# Altium project MAX_2870.PrjPCB
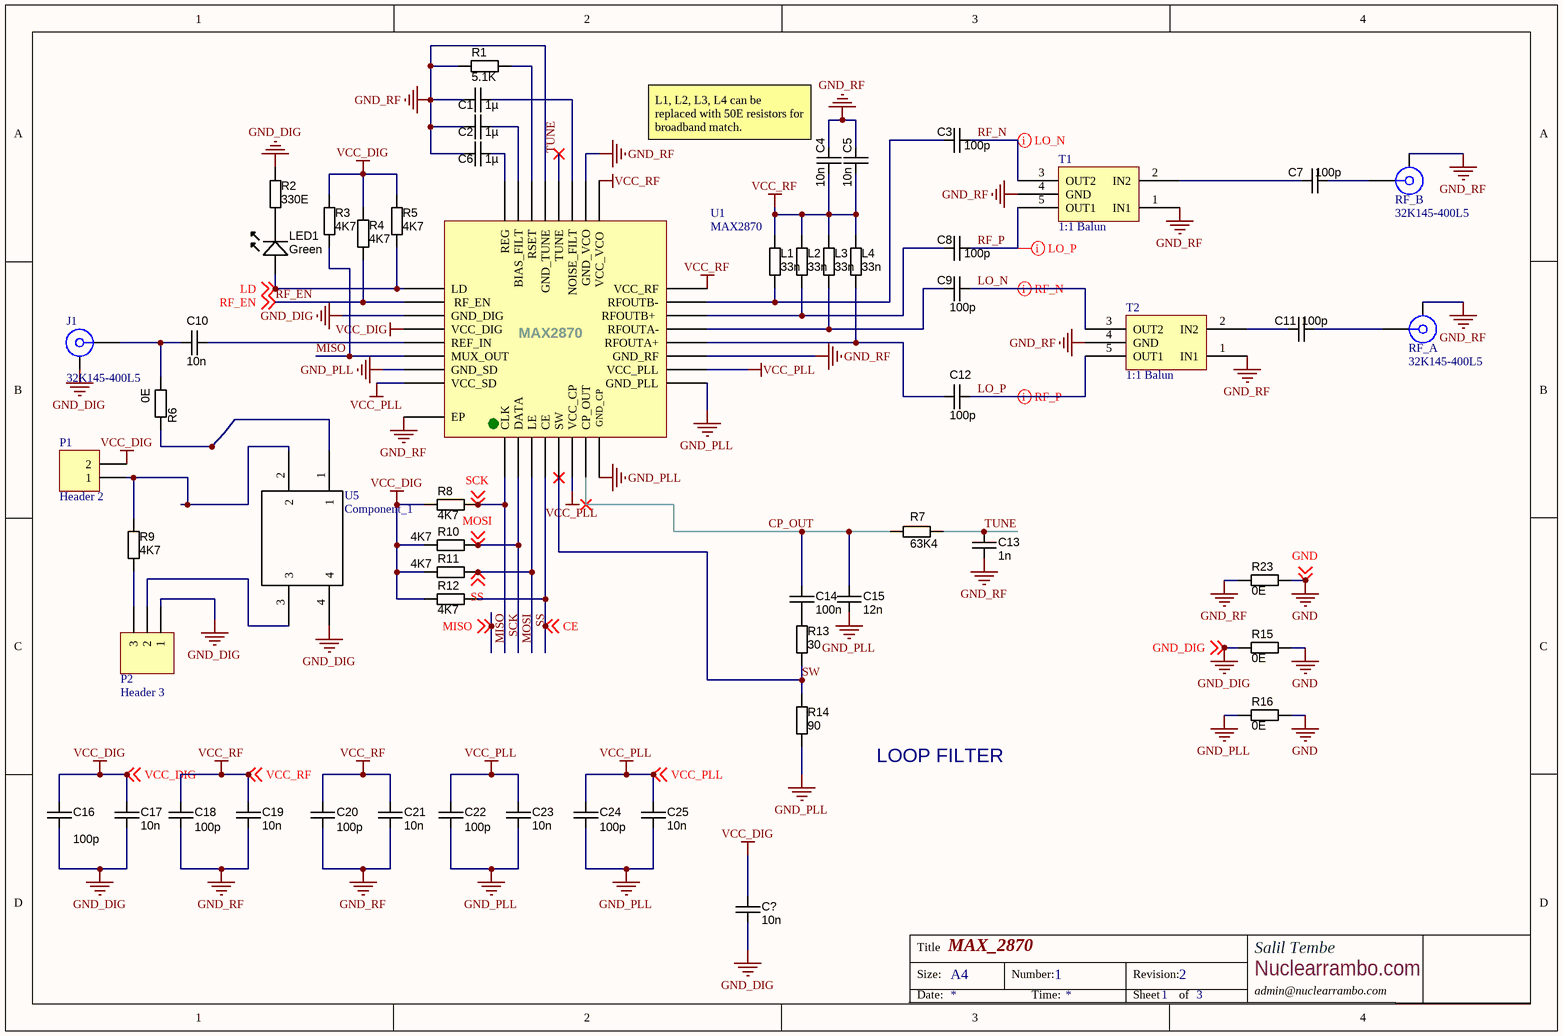
[diagram p0: MAX_2870.SchDoc]
3 sheets, 89 parts. Net scope: flat (ports and power ports of the same name join across sheets).
Board file: MAX_2870.PcbDoc
Sheets:
  MAX_2870.SchDoc
  Power_Supply.SchDoc
  PLL_Controller_STM32.SchDoc

## Sheet MAX_2870.SchDoc: MAX_2870
size A4; Author: Salil Tembe; DrawnBy: Salil Tembe; Organization: Salil Tembe; Address1: Nuclearrambo.com; Address2: admin@nuclearrambo.com; DocumentNumber: 1; Revision: 2; SheetNumber: 1; SheetTotal: 3

### Parts
C1  value 1µ  [CAPC1608X90N]  (hidden comment: approved sub OK)
C2  value 1µ  [CAPC1608X90N]  (hidden comment: approved sub OK)
C3  100p  [CAPC1005X55N]
C4  value 10n  [CAPC1608X90N]  (hidden comment: approved sub OK)
C5  value 10n  [CAPC1608X90N]  (hidden comment: approved sub OK)
C6  value 1µ  [CAPC1608X90N]  (hidden comment: approved sub OK)
C7  100p  [CAPC1005X55N]
C8  100p  [CAPC1005X55N]
C9  100p  [CAPC1005X55N]
C10  value 10n  [CAPC1608X90N]  (hidden comment: approved sub OK)
C11  100p  [CAPC1005X55N]
C12  100p  [CAPC1005X55N]
C13  1n  [CAPC1608X90N]
C14  value 100n  [CAPC1608X90N]  (hidden comment: approved sub OK)
C15  12n  [CAPC1608X90N]
C16  100p  [CAPC1608X90N]
C17  value 10n  [CAPC1608X90N]  (hidden comment: approved sub OK)
C18  100p  [CAPC1608X90N]
C19  value 10n  [CAPC1608X90N]  (hidden comment: approved sub OK)
C20  100p  [CAPC1608X90N]
C21  value 10n  [CAPC1608X90N]  (hidden comment: approved sub OK)
C22  100p  [CAPC1608X90N]
C23  value 10n  [CAPC1608X90N]  (hidden comment: approved sub OK)
C24  100p  [CAPC1608X90N]
C25  value 10n  [CAPC1608X90N]  (hidden comment: approved sub OK)
C?  value 10n  [CAPC1608X90N]  (hidden comment: approved sub OK)
J1  32K145-400L5  [ROS-32K145-400L5_V]
L1  value 33n  [RESC1005X40N]  (hidden comment: Thick Film)
L2  value 33n  [RESC1005X40N]  (hidden comment: Thick Film)
L3  value 33n  [RESC1005X40N]  (hidden comment: Thick Film)
L4  value 33n  [RESC1005X40N]  (hidden comment: Thick Film)
LED1  Green  [LED-0603-GREEN]
P1  Header 2  [HDR1X2]
P2  Header 3  [HDR1X3]
R1  value 5.1K  [RESC2012X70N]  (hidden comment: Thick Film)
R2  value 330E  [RESC1608X55N]  (hidden comment: Thick Film)
R3  value 4K7  [RESC1005X40N]  (hidden comment: Thick Film)
R4  value 4K7  [RESC1005X40N]  (hidden comment: Thick Film)
R5  value 4K7  [RESC1005X40N]  (hidden comment: Thick Film)
R6  value 0E  [RESC1608X55N]  (hidden comment: Thick Film)
R7  value 63K4  [RESC1608X55N]  (hidden comment: Thick Film)
R8  value 4K7  [RESC1005X40N]  (hidden comment: Thick Film)
R9  value 4K7  [RESC2012X70N]  (hidden comment: Thick Film)
R10  value 4K7  [RESC1005X40N]  (hidden comment: Thick Film)
R11  value 4K7  [RESC1005X40N]  (hidden comment: Thick Film)
R12  value 4K7  [RESC1005X40N]  (hidden comment: Thick Film)
R13  value 30  [RESC1608X55N]  (hidden comment: Thick Film)
R14  value 90  [RESC1608X55N]  (hidden comment: Thick Film)
R15  value 0E  [RESC1608X55N]  (hidden comment: Thick Film)
R16  value 0E  [RESC1608X55N]  (hidden comment: Thick Film)
R23  value 0E  [RESC1608X55N]  (hidden comment: Thick Film)
RF_A  32K145-400L5  [ROS-32K145-400L5_V]
RF_B  32K145-400L5  [ROS-32K145-400L5_V]
T1  1:1 Balun  [ETC-1-1-13R]
T2  1:1 Balun  [ETC-1-1-13R]
U1  MAX2870  [TQFN]
U5  Component_1  [5mm x 7mm TCXO]

### Nets
GND: R15.2 R16.2 R23.2 ; off-sheet GND
GND_DIG: C16.2 C17.2 C?.2 J1.MP P2.1 R2.1 R15.1 U1.27(GND_DIG) U5.4 ; off-sheet GND_DIG
GND_PLL: C15.1 C22.2 C23.2 C24.2 C25.2 R14.2 R16.1 U1.8(GND_CP) U1.9(GND_PLL) U1.31(GND_SD)
GND_RF: C1.2 C2.1 C4.2 C5.2 C6.1 C13.2 C18.2 C19.2 C20.2 C21.2 R1.2 R23.1 RF_A.MP RF_B.MP T1.1(IN1) T1.4(GND) T2.1(IN1) T2.4(GND) U1.11(GND_RF) U1.18(GND_VCO) U1.21(GND_TUNE) U1.33(EP)
VCC_DIG: C16.1 C17.1 C?.1 P1.2 R3.2 R4.2 R5.2 R8.1 R10.1 R11.1 R12.1 U1.28(VCC_DIG) ; off-sheet VCC_DIG
VCC_PLL: C22.1 C23.1 C24.1 C25.1 U1.6(VCC_CP) U1.10(VCC_PLL) U1.32(VCC_SD) ; off-sheet VCC_PLL
VCC_RF: C4.1 C5.1 C18.1 C19.1 C20.1 C21.1 L1.1 L2.1 L3.1 L4.1 U1.16(VCC_RF) U1.17(VCC_VCO) ; off-sheet VCC_RF
CE: R12.2 U1.4(CE) ; off-sheet CE
CP_OUT: C14.1 C15.2 R7.2 U1.7(CP_OUT)
LD: LED1.A R5.1 U1.25(LD) ; off-sheet LD
LO_N: C9.2 T2.3(OUT2)
LO_P: C12.2 T2.5(OUT1)
MISO: R3.1 U1.30(MUX_OUT) ; off-sheet MISO
MOSI: R10.2 U1.2(DATA) ; off-sheet MOSI
RF_EN: R4.1 U1.26(RF_EN) ; off-sheet RF_EN
RF_N: C3.2 T1.3(OUT2)
RF_P: C8.2 T1.5(OUT1)
SCK: R8.2 U1.1(CLK) ; off-sheet SCK
SS: R11.2 U1.3(LE) ; off-sheet SS
SW: R13.2 R14.1 U1.5(SW)
TUNE: C13.1 R7.1 U1.20(TUNE)
NetC1_1: C1.1 U1.19(NOISE_FILT)
NetC2_2: C2.2 U1.23(BIAS_FILT)
NetC3_1: C3.1 L1.2 U1.15(RFOUTB-)
NetC6_2: C6.2 U1.24(REG)
NetC7_1: C7.1 T1.2(IN2)
NetC7_2: C7.2 RF_B.1
NetC8_1: C8.1 L2.2 U1.14(RFOUTB+)
NetC9_1: C9.1 L3.2 U1.13(RFOUTA-)
NetC10_1: C10.1 J1.1 R6.2
NetC10_2: C10.2 U1.29(REF_IN)
NetC11_1: C11.1 T2.2(IN2)
NetC11_2: C11.2 RF_A.1
NetC12_1: C12.1 L4.2 U1.12(RFOUTA+)
NetC14_2: C14.2 R13.1
NetLED1_K: LED1.K R2.2
NetP1_1: P1.1 R9.1 U5.2
NetP2_2: P2.2 U5.3
NetP2_3: P2.3 R9.2
NetR1_1: R1.1 U1.22(RSET)
NetR6_1: R6.1 U5.1

### Layout directives
differential pair: LO_N, LO_P, RF_N, RF_P

### Notes on the sheet
- (near C4) L1, L2, L3, L4 can be replaced with 50E resistors for broadband match.
- LOOP FILTER
- Title
- Size:
- A4
- Number:
- Revision:
- Date:
- Time:
- Sheet
- of

### Library data of the parts
C1 C2 C6 = CAPC_1u_0603_X7R_16V_10%: Capacitor SMD Cer 1uF 10% 16V X7R 0603; Manufacturer 1: TDK Corporation; Manufacturer Part Number 1: C1608X7R1C105K; Ratings: 16V; X7R; Material: ceramic; SCDType: spec; Package / Case: 0603 (1608 metric); Tolerance: ±10%; Supplier 1: Digi-Key; Supplier Part Number 1: 445-1604-1-ND; ComponentLink1URL: http://product.tdk.com/capacitor/mlcc/en/documents/mlcc_commercial_general_en.pdf; ComponentLink1Description: http://product.tdk.com/capacitor/mlcc/en/documents/mlcc_commercial_general_en.pdf
C3 C7-C9 C11 C12 = CAPC_100p_0402_NP0_50V_5%: Capacitor SMD Cer 100pF 5% 50V NP0 0402; Manufacturer 1: Yageo; Manufacturer Part Number 1: CC0402JRNPO9BN101; Ratings: 50V; NP0; SCDType: spec; Tolerance: ±5%; Operating Temperature: -55°C ~ 125°C; Package / Case: 0402 (1005 Metric); Size / Dimension: 0.039" L x 0.020" W (1.00mm x 0.50mm); Supplier 1: Digi-Key; Supplier Part Number 1: 311-1024-1-ND; RoHS 1: RoHS Compliant; ComponentLink1URL: http://www.yageo.com/documents/recent/UPY-GP_NP0_16V-to-50V_9.pdf; ComponentLink1Description: http://www.yageo.com/documents/recent/UPY-GP_NP0_16V-to-50V_9.pdf; Supplier 2: Digi-Key; Supplier Part Number 2: 1276-1025-1-ND; Manufacturer 2: Samsung Electro-Mechanics America, Inc; Manufacturer Part Number 2: CL05C101JB5NNNC; RoHS 2: RoHS Compliant; ComponentLink2URL: http://www.samsungsem.com/servlet/FileDownload?type=spec&file=CL05C101JB5NNNC.pdf; ComponentLink2Description: http://www.samsungsem.com/servlet/FileDownload?type=spec&file=CL05C101JB5NNNC.pdf; Supplier 3: Digi-Key; Supplier Part Number 3: 445-1247-1-ND; Manufacturer 3: TDK Corporation; Manufacturer Part Number 3: C1005C0G1H101J050BA; RoHS 3: RoHS Compliant; ComponentLink3URL: http://product.tdk.com/capacitor/mlcc/en/documents/mlcc_commercial_general_en.pdf; ComponentLink3Description: http://product.tdk.com/capacitor/mlcc/en/documents/mlcc_commercial_general_en.pdf; Supplier 4: Digi-Key; Supplier Part Number 4: 399-3194-1-ND; Manufacturer 4: Kemet; Manufacturer Part Number 4: C0402C101J5GACTU; RoHS 4: RoHS Compliant; ComponentLink4URL: http://www.kemet.com/datasheets&C0402C101J5GACTU; ComponentLink4Description: http://www.kemet.com/datasheets&C0402C101J5GACTU; Value: 100p
C4 C5 C10 C17 C19 C21 C23 C25 C? = CAPC_10n_0603_X7R_100V_10%: Capacitor SMD Cer 10nF 10% 100V X7R 0603; Manufacturer: Murata Electronics North America; Manufacturer Part Number: GCM188R72A103KA37D; Ratings: 100V; X7R; Material: ceramic; SCDType: undef; Package / Case: 0603 (1608 metric); Tolerance: ±10%; Supplier 1: Digi-Key; Supplier Part Number 1: 490-4781-1-ND
C13 C15 C16 C18 C20 C22 C24 = CAPC_100p_0603_NP0_50V_1%: Capacitor SMD Cer 100pF 1% 50V NP0 0603; Manufacturer 1: AVX Corporation; Manufacturer Part Number 1: 06035A101FAT2A; Ratings: 50V; NP0; SCDType: source; Operating Temperature: -55°C ~ 125°C; Package / Case: 0603 (1608 Metric); Size / Dimension: 0.063" L x 0.032" W (1.60mm x 0.81mm); Thickness (Max): 0.035" (0.90mm); ComponentLink1URL: http://www.avx.com/docs/Catalogs/ccog.pdf; ComponentLink1Description: http://www.avx.com/docs/Catalogs/ccog.pdf; Supplier 1: Digi-Key; Supplier Part Number 1: 478-6202-1-ND; Supplier 2: Digi-Key; Supplier Part Number 2: 1276-2159-1-ND; Manufacturer 2: Samsung Electro-Mechanics America, Inc; Manufacturer Part Number 2: CL10C101FB8NNNC; RoHS 2: RoHS Compliant; ComponentLink2URL: http://www.samsungsem.com/servlet/FileDownload?type=spec&file=CL10C101FB8NNNC.pdf; ComponentLink2Description: http://www.samsungsem.com/servlet/FileDownload?type=spec&file=CL10C101FB8NNNC.pdf; RoHS 1: RoHS Compliant; Supplier 3: Digi-Key; Supplier Part Number 3: 399-7819-1-ND; Manufacturer 3: Kemet; Manufacturer Part Number 3: C0603C101F5GACTU; RoHS 3: RoHS Compliant; ComponentLink3URL: http://www.kemet.com/datasheets&C0603C101F5GACTU; ComponentLink3Description: http://www.kemet.com/datasheets&C0603C101F5GACTU; Tolerance: ±1%
  C13: Value: 1n
  C15: Value: 12n
  C16 C18 C20 C22 C24: Value: 100p
C14 = CAPC_100n_0603_X7R_50V_10%: Capacitor SMD Cer 100nF 10% 50V X7R 0603; Manufacturer 1: AVX Corporation; Manufacturer Part Number 1: 06035C104KAT2A; Ratings: 50V; X7R; Material: ceramic; SCDType: spec; Manufacturer 2: TDK Corporation; Manufacturer Part Number 2: C1608X7R1H104K; Package / Case: 0603 (1608 Metric); Tolerance: ±10%; Supplier 1: Digi-Key; Supplier Part Number 1: 478-5052-1-ND; ComponentLink1URL: http://www.avx.com/docs/Catalogs/cx7r.pdf; ComponentLink1Description: http://www.avx.com/docs/Catalogs/cx7r.pdf; Supplier 2: Digi-Key; Supplier Part Number 2: 445-1314-1-ND; ComponentLink2URL: http://product.tdk.com/capacitor/mlcc/en/documents/mlcc_commercial_general_en.pdf; ComponentLink2Description: http://product.tdk.com/capacitor/mlcc/en/documents/mlcc_commercial_general_en.pdf
J1 RF_A RF_B = 32K145-400L5: SMA Right Angle Jack, Edge Mount, Up to 18 GHz, -55 to 155 degC; Design Note 1: Footprint in library is a generic example - only application specific footprint delivers High Performance; Desgin Note 2: For more information about DRC setting, please look at following webpage, http://techdocs.altium.com/display/SCRT/Design+Rule+for+Edge-Mount+Connectors; DatasheetVersion: b00; PackageVersion: b00; PackageReference: 32K145-400L5; PackageDescription: SMA Right Angle Jack, Edge Mount, 14.25 x 9.5 x 4.46 mm; Mounting Technology: Surface Mount; PartNumber: 32K145-400L5; ComponentLink1Description: Manufacturer URL; ComponentLink1URL: http://www.rosenberger.de; ComponentLink2Description: Datasheet; ComponentLink2URL: http://rosenberger.de/ok/images/documents/db/32K145-400L5.pdf; ComponentLink3Description: Package Specification; ComponentLink3URL: http://rosenberger.de/ok/images/documents/db/32K145-400L5.pdf; ComponentLink4Description: Series Overview / Design Note; ComponentLink4URL: http://rosenberger.de/ok/images/documents/spez/32.pdf; ComponentLink5Description: Webshop / RFQ; ComponentLink5URL: http://www.rosenberger.com/en/contact/sales/
L1-L4 = RES_100K_0402_5%: Resistor SMD chip 100k Ohm 0.063W 5% 0402; Manufacturer 1: Vishay Dale; Manufacturer Part Number 1: CRCW0402100KJNED; Ratings: 1/16 W; SCDType: undef; Package / Case: 0402 (1005 Metric); Tolerance: ±5%; ComponentLink2URL: http://www.yageo.com/documents/recent/PYu-RC0402_51_RoHS_L_6.pdf; ComponentLink2Description: http://www.yageo.com/documents/recent/PYu-RC0402_51_RoHS_L_6.pdf; Supplier 1: Digi-Key; Supplier Part Number 1: 541-100KJCT-ND; ComponentLink1URL: http://www.vishay.com/doc?20035; ComponentLink1Description: http://www.vishay.com/doc?20035; Supplier 2: Digi-Key; Supplier Part Number 2: 311-100KJRCT-ND; Manufacturer 2: Yageo; Manufacturer Part Number 2: RC0402JR-07100KL
LED1 = LED_SMD_Green_0603_570nm: LED 0603 SMD Green 570nm 50mcd 20mA; Manufacturer 1: Kingbright Company LLC; Manufacturer Part Number 1: APT1608CGCK; Material: AlGaInP; Ratings: 20mcd min; 50 mcd typ; 570 nm; Voltage - Forward (Vf) Typ: 2.1V; Viewing Angle: 120°; Lens Style/Size: Rectangle with Flat Top, 1.1mm x 0.8mm; Voltage - Forward (Vf) @ 10mA: 2.0V; SCDType: source; Wavelength - Peak: 574nm; Lens Type: Clear; Package / Case: 0603 (1608 metric); Color: Green; Current - Test: 20mA; Supplier 1: Digi-Key; Supplier Part Number 1: 754-1116-1-ND; RoHS 1: RoHS Compliant; Wavelength - Dominant: 570nm; ComponentLink1URL: http://www.us.kingbright.com/images/catalog/SPEC/APT1608CGCK.pdf; ComponentLink1Description: http://www.us.kingbright.com/images/catalog/SPEC/APT1608CGCK.pdf
P1 = Header 2: Header, 2-Pin; LatestRevisionDate: 17-Jul-2002; LatestRevisionNote: Re-released for DXP Platform.; Publisher: Altium Limited
P2 = Header 3: Header, 3-Pin; LatestRevisionDate: 17-Jul-2002; LatestRevisionNote: Re-released for DXP Platform.; Publisher: Altium Limited
R1 = RES_51K_0805_1%: Resistor SMD chip 51k Ohm 0.125W 1% 0805; Manufacturer 1: Yageo; Manufacturer Part Number 1: RC0805FR-0751KL; Ratings: 1/8W; SCDType: spec; Package / Case: 0805 (2012 Metric); Supplier 1: Digi-Key; Supplier Part Number 1: 311-51.0KCRCT-ND; Tolerance: ±1%
R2 = RES_3K3_0603_5%: Resistor SMD chip 3.3k Ohm 0.1W 5% 0603; Manufacturer 1: Yageo; Manufacturer Part Number 1: RC0603JR-073K3L; Ratings: 1/10 W; SCDType: undef; Package / Case: 0603 (1608 metric); Tolerance: ±5%; Material: thick film; Supplier 1: Digi-Key; Supplier Part Number 1: 311-3.3KGRTR-ND
R3-R5 R8 R10-R12 = RES_1M_0402_5%: Resistor SMD chip 1M Ohm 0.063W 5% 0402; Manufacturer 1: Vishay Dale; Manufacturer Part Number 1: CRCW04021M00JNED; Ratings: 1/16 W; SCDType: spec; Power Rating: 0.063W, 1/16W; Package / Case: 0402 (1005 Metric); Tolerance: ±5%; Material: Thick Film; Supplier 1: Digi-Key; Supplier Part Number 1: 541-1.0MJCT-ND; Manufacturer 2: Yageo; Manufacturer Part Number 2: RC0402JR-071ML; ComponentLink1URL: http://www.vishay.com/doc?20035; ComponentLink1Description: http://www.vishay.com/doc?20035; Supplier 2: Digi-Key; Supplier Part Number 2: 311-1.0MJRCT-ND; ComponentLink2URL: http://www.yageo.com/documents/recent/PYu-RC0402_51_RoHS_L_6.pdf; ComponentLink2Description: http://www.yageo.com/documents/recent/PYu-RC0402_51_RoHS_L_6.pdf
R6 R7 R13 R14 = RES_63K4_0603_1%: Resistor SMD chip 63.4K Ohm 0.1W 1% 0603; Manufacturer 1: Yageo; Manufacturer Part Number 1: RC0603FR-0763K4L; Ratings: 1/10W; SCDType: spec; Package / Case: 0603 (1608 Metric); Supplier 1: Digi-Key; Supplier Part Number 1: 311-63.4KHRCT-ND; ComponentLink1URL: http://www.yageo.com/documents/recent/PYu-RC0603_51_RoHS_L_4.pdf; ComponentLink1Description: http://www.yageo.com/documents/recent/PYu-RC0603_51_RoHS_L_4.pdf; Tolerance: ±1%
R9 = RES_4K7_0805_1%: Resistor SMD chip 4.7k Ohm 0.125W 1% 0805; Manufacturer 1: Vishay/Dale; Manufacturer Part Number 1: CRCW08054K70FKEA; Ratings: 1/8W; SCDType: spec; Package / Case: 0805 (2012 metric); Supplier 1: Digi-Key; Supplier Part Number 1: 541-4.70KCCT-ND; Tolerance: ±1%
R15 R16 R23 = RES_1K_0603_1%: Resistor SMD chip 1k Ohm 0.1W 1% 0603; Manufacturer 1: Yageo; Manufacturer Part Number 1: RC0603FR-071KL; Ratings: 1/10W; SCDType: spec; Package / Case: 0603 (1608 Metric); Supplier 1: Digi-Key; Supplier Part Number 1: 311-1.00KHRCT-ND
T1 T2 = ETC-1-1-13R: ETC-1-1-13R 1:1 Balun; ComponentLink1Description: Datasheet; ComponentLink1URL: https://cdn.macom.com/datasheets/ETC1-1-13.pdf
U1 = MAX2870: MAX2870 PLL with VCO

## Sheet Power_Supply.SchDoc: MAX_2870
size A4; Author: Salil Tembe; Organization: Salil Tembe; Address1: Nuclearrambo.com; Address2: admin@nuclearrambo.com; DocumentNumber: 3; Revision: 2; SheetNumber: 3; SheetTotal: 3
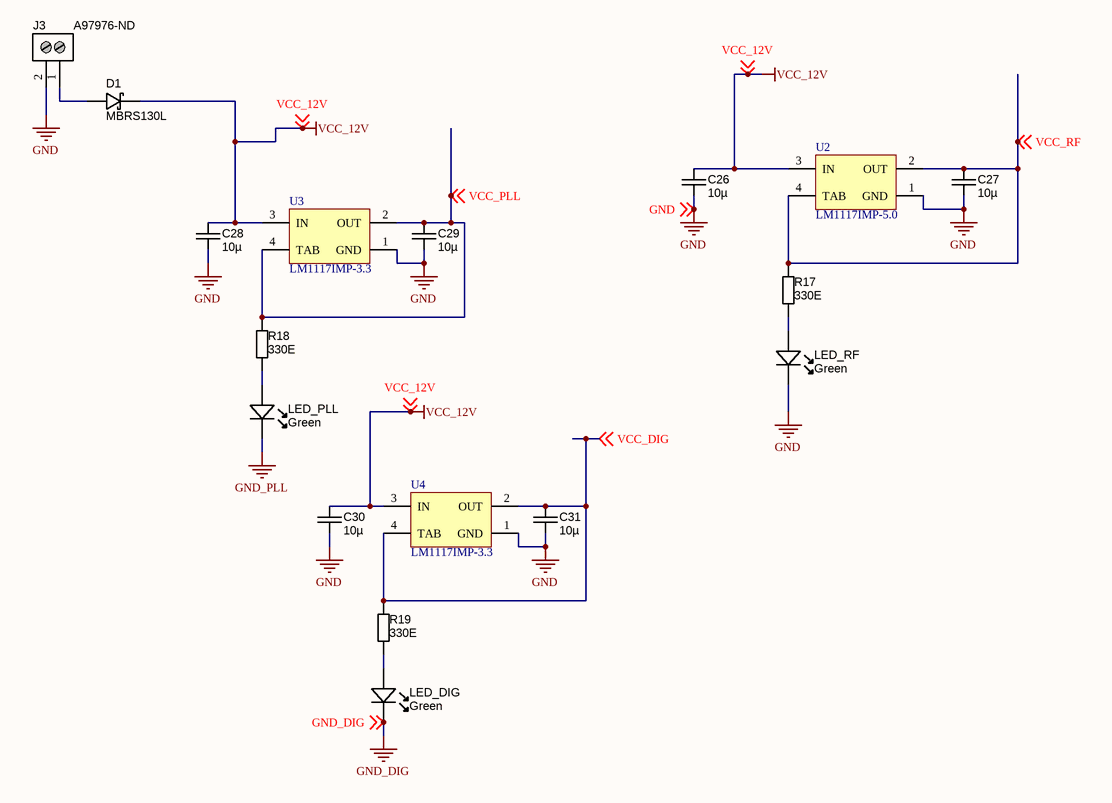
[diagram p1: Power_Supply.SchDoc]

### Parts
C26  value 10µ  [CAPC3216X180N]  (hidden comment: approved sub OK)
C27  value 10µ  [CAPC3216X180N]  (hidden comment: approved sub OK)
C28  value 10µ  [CAPC3216X180N]  (hidden comment: approved sub OK)
C29  value 10µ  [CAPC3216X180N]  (hidden comment: approved sub OK)
C30  value 10µ  [CAPC3216X180N]  (hidden comment: approved sub OK)
C31  value 10µ  [CAPC3216X180N]  (hidden comment: approved sub OK)
D1  MBRS130L  [DO-214AA]
J3  Supplier Part Number 1: A97976-ND  [2P_PCB_ScrewTerm_90S_3.81MM]  (hidden comment: Stackable ScrewTerm)
LED_DIG  Green  [LED-0603-GREEN]
LED_PLL  Green  [LED-0603-GREEN]
LED_RF  Green  [LED-0603-GREEN]
R17  value 330E  [RESC1608X55N]  (hidden comment: Thick Film)
R18  value 330E  [RESC1608X55N]  (hidden comment: Thick Film)
R19  value 330E  [RESC1608X55N]  (hidden comment: Thick Film)
U2  LM1117IMP-5.0  [SOT223_L]
U3  LM1117IMP-3.3  [SOT223_L]
U4  LM1117IMP-3.3  [SOT223_L]

### Nets
GND: C26.2 C27.2 C28.2 C29.2 C30.2 C31.2 J3.2 LED_RF.K U2.1(GND) U3.1(GND) U4.1(GND) ; off-sheet GND
GND_DIG: LED_DIG.K ; off-sheet GND_DIG
GND_PLL: LED_PLL.K
VCC_12V: C26.1 C28.1 C30.1 D1.K U2.3(IN) U3.3(IN) U4.3(IN) ; off-sheet VCC_12V
VCC_DIG: C31.1 R19.1 U4.2(OUT) U4.4(TAB) ; off-sheet VCC_DIG
VCC_PLL: C29.1 R18.1 U3.2(OUT) U3.4(TAB) ; off-sheet VCC_PLL
VCC_RF: C27.1 R17.1 U2.2(OUT) U2.4(TAB) ; off-sheet VCC_RF
NetD1_A: D1.A J3.1
NetLED_DIG_A: LED_DIG.A R19.2
NetLED_PLL_A: LED_PLL.A R18.2
NetLED_RF_A: LED_RF.A R17.2

### Notes on the sheet
- Title
- Size:
- A4
- Number:
- Revision:
- Date:
- Time:
- Sheet
- of

### Library data of the parts
C26-C31 = CAPC_10u_1206_16V: Capacitor SMD Cer 10uF 10% 16V X7R 1206; Manufacturer 1: Kemet; Manufacturer Part Number 1: C1206C106K4RACTU; Ratings: 16V; X7R; SCDType: spec; Material: ceramic; Tolerance: ±10%; Package / Case: 1206 (3216 metric); Supplier 1: Digi-Key; Supplier Part Number 1: 399-3525-1-ND
D1 = DIODE_SCHOTTKY_MBRS130L: Diode Schottky SMD 30V 2A DO-214AA; Manufacturer 1: Fairchild Semiconductor; Material: Si; Ratings: 30Vr; 2A; SCDType: source; Package / Case: DO-214AA, SMB; Supplier 1: Digi-Key; Supplier Part Number 1: MBRS130LFSCT-ND; Manufacturer Part Number 1: MBRS130L
J3 = 2P_ScrewTerm_90S_3.81MM: Terminal Block Screw Type THT 2-Position 3.81mm pitch; Manufacturer 1: Tyco Electronics; Manufacturer Part Number 1: 1776113-2; Value: 2 position; Pitch: 0.150" (3.81mm); Positions Per Level: 2; SCDType: undef; Package / Case: Side Entry; 3.81mm pitch; Category: Connectors Interconnects; Color: Black; Supplier 1: Digi-Key
LED_DIG LED_PLL LED_RF = LED_SMD_Green_0603_570nm: LED 0603 SMD Green 570nm 50mcd 20mA; Manufacturer 1: Kingbright Company LLC; Manufacturer Part Number 1: APT1608CGCK; Ratings: 20mcd min; 50 mcd typ; 570 nm; Voltage - Forward (Vf) Typ: 2.1V; Viewing Angle: 120°; Lens Style/Size: Rectangle with Flat Top, 1.1mm x 0.8mm; Voltage - Forward (Vf) @ 10mA: 2.0V; SCDType: source; Wavelength - Peak: 574nm; Lens Type: Clear; Package / Case: 0603 (1608 metric); Material: AlGaInP; Color: Green; Current - Test: 20mA; Supplier 1: Digi-Key; Supplier Part Number 1: 754-1116-1-ND; RoHS 1: RoHS Compliant; Wavelength - Dominant: 570nm; ComponentLink1URL: http://www.us.kingbright.com/images/catalog/SPEC/APT1608CGCK.pdf; ComponentLink1Description: http://www.us.kingbright.com/images/catalog/SPEC/APT1608CGCK.pdf
R17-R19 = RES_1K5_0603_5%: Resistor SMD chip 1.5k Ohm 0.1W 5% 0603; Manufacturer 1: Yageo; Manufacturer Part Number 1: RC0603JR-071K5L; Ratings: 1/10 W; SCDType: spec; Package / Case: 0603 (1608 metric); Tolerance: ±5%; Material: thick film; Supplier 1: Digi-Key; Supplier Part Number 1: 311-1.5KGRCT-ND
U2 = LM1117IMP-5.0: 800mA Low-Dropout Linear Regulator, 4-pin SOT-223; Manufacturer: National Semiconductor; PackageTopMarking: XYTT*N06B; PowerWise: N; CompType: LDO IC; Published: 4-Dec-2008; DatasheetVersion: Apr-2006; PackageVersion: revB, Apr-2003; PackageReference: MP04A; Publisher: Altium Limited; PackageDescription: Molded SOT-223, 6.50 x 3.56 x 1.6mm Body, 4 Lead, 2.3mm Pitch; Supplier 1: Farnell; Supplier Part Number 1: 7614135; PartNumber: LM1117IMP-5.0; RoHS: N; PinCount: 4; Code_JEDEC: TO-261-AA; Code_IPC: SOT223-4; ComponentLink1Description: LM1117 Datasheet; ComponentLink1URL: http://www.national.com/ds/LM/LM1117.pdf; ComponentLink2Description: LM1117 Web Page; ComponentLink2URL: http://www.national.com/pf/LM/LM1117.html; ComponentLink3Description: MP04A Package Page; ComponentLink3URL: http://www.national.com/packaging/folders/mp04a.html
U3 U4 = LM1117IMP-3.3: 800mA Low-Dropout Linear Regulator, 4-pin SOT-223; Manufacturer: National Semiconductor; PackageTopMarking: XYTT*N05B; PowerWise: N; CompType: LDO IC; Published: 4-Dec-2008; DatasheetVersion: Apr-2006; PackageVersion: revB, Apr-2003; PackageReference: MP04A; Publisher: Altium Limited; PackageDescription: Molded SOT-223, 6.50 x 3.56 x 1.6mm Body, 4 Lead, 2.3mm Pitch; Supplier 1: Farnell; Supplier Part Number 1: 7614123; PartNumber: LM1117IMP-3.3; RoHS: N; PinCount: 4; Code_JEDEC: TO-261-AA; Code_IPC: SOT223-4; ComponentLink1Description: LM1117 Datasheet; ComponentLink1URL: http://www.national.com/ds/LM/LM1117.pdf; ComponentLink2Description: LM1117 Web Page; ComponentLink2URL: http://www.national.com/pf/LM/LM1117.html; ComponentLink3Description: MP04A Package Page; ComponentLink3URL: http://www.national.com/packaging/folders/mp04a.html

## Sheet PLL_Controller_STM32.SchDoc: MAX_2870
size A4; Organization: Salil Tembe; Address1: Nuclearrambo.com; Address2: admin@nuclearrambo.com; DocumentNumber: 2; Revision: 2; SheetNumber: 2; SheetTotal: 3
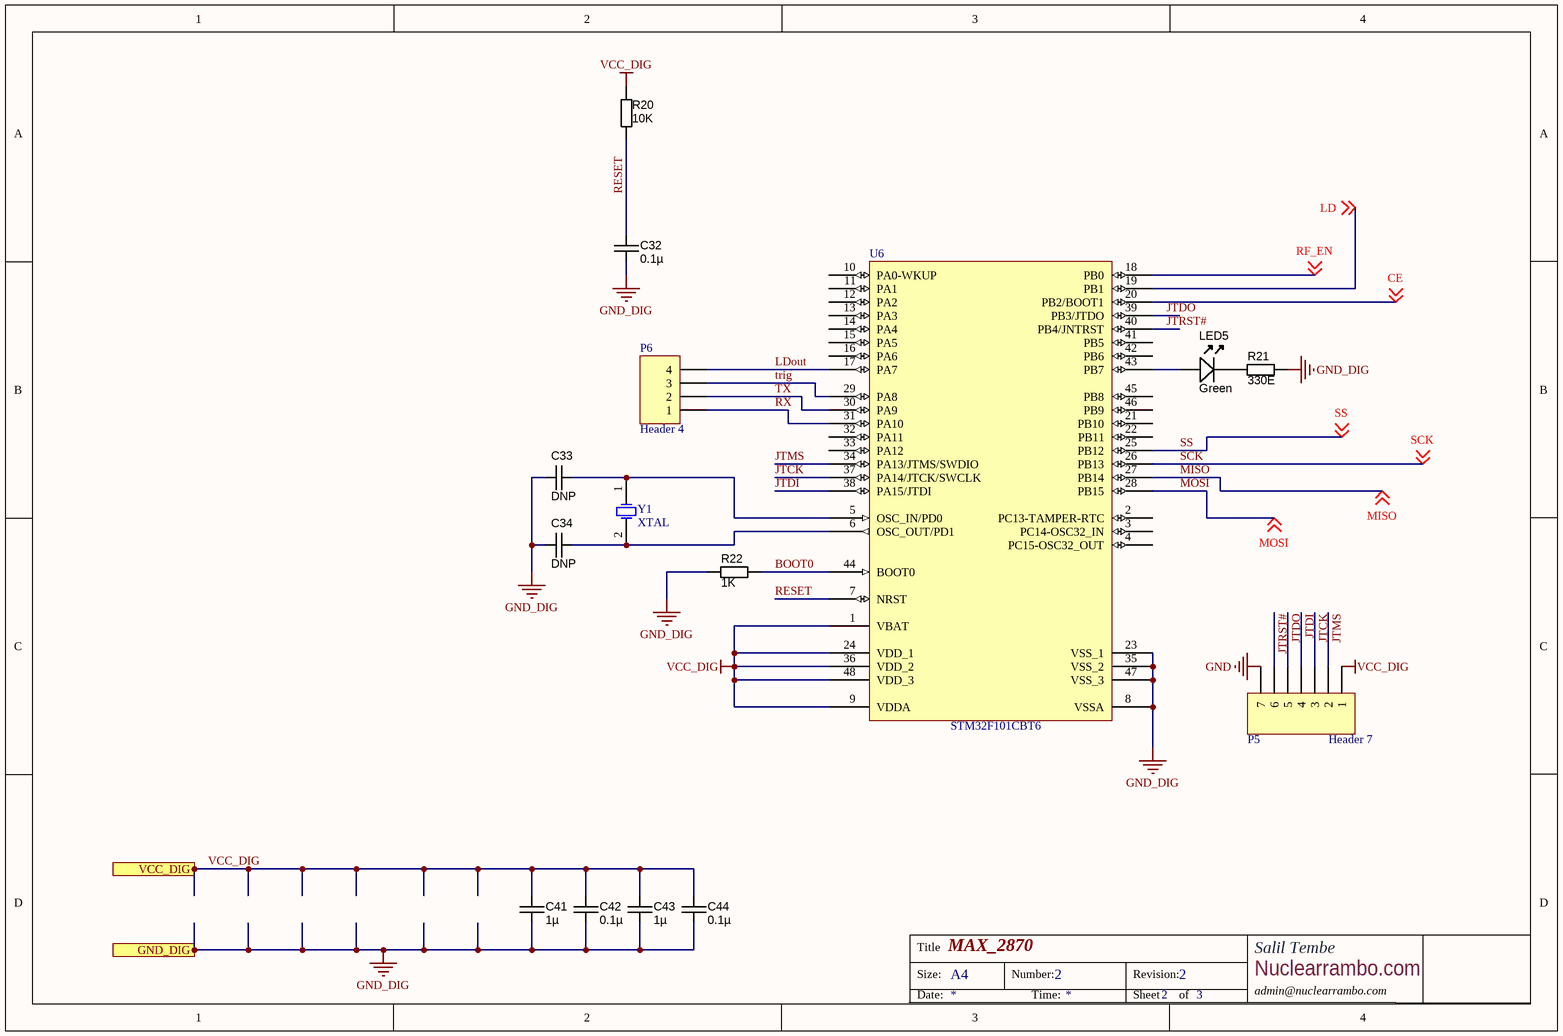
[diagram p2: PLL_Controller_STM32.SchDoc]

### Parts
C32  value 0.1µ  [CAPC2012X135N]  (hidden comment: approved sub OK)
C33  value DNP  [CAPC2012X135N]  (hidden comment: approved sub OK)
C34  value DNP  [CAPC2012X135N]  (hidden comment: approved sub OK)
C41  value 1µ  [CAPC2012X135N]  (hidden comment: approved sub OK)
C42  value 0.1µ  [CAPC2012X135N]  (hidden comment: approved sub OK)
C43  value 1µ  [CAPC2012X135N]  (hidden comment: approved sub OK)
C44  value 0.1µ  [CAPC2012X135N]  (hidden comment: approved sub OK)
LED5  Green  [LED-0603-GREEN]
P5  Header 7  [HDR1X7]
P6  Header 4  [HDR1X4]
R20  value 10K  [RESC1005X40N]  (hidden comment: Thick Film)
R21  value 330E  [RESC1005X40N]  (hidden comment: Thick Film)
R22  value 1K  [RESC1005X40N]  (hidden comment: Thick Film)
U6  STM32F101CBT6  [LQFP48_N]
Y1  XTAL  [R38]

### Ports
GND_DIG (in), VCC_DIG (in)

### Nets
GND: P5.7
GND_DIG: C32.1 C33.1 C34.1 C41.1 C42.1 C43.1 C44.1 R21.2 R22.1 U6.8(VSSA) U6.23(VSS_1) U6.35(VSS_2) U6.47(VSS_3) ; port GND_DIG
VCC_DIG: C41.2 C42.2 C43.2 C44.2 P5.1 R20.2 U6.1(VBAT) U6.9(VDDA) U6.24(VDD_1) U6.36(VDD_2) U6.48(VDD_3) ; port VCC_DIG
BOOT0: R22.2 U6.44(BOOT0)
CE: U6.20(PB2/BOOT1) ; off-sheet CE
JTCK: P5.3 U6.37(PA14/JTCK/SWCLK)
JTDI: P5.4 U6.38(PA15/JTDI)
JTDO: P5.5 U6.39(PB3/JTDO)
JTMS: P5.2 U6.34(PA13/JTMS/SWDIO)
JTRST#: P5.6 U6.40(PB4/JNTRST)
LD: U6.19(PB1) ; off-sheet LD
LDout: P6.4 U6.17(PA7)
MISO: U6.27(PB14) ; off-sheet MISO
MOSI: U6.28(PB15) ; off-sheet MOSI
RESET: C32.2 R20.1 U6.7(NRST)
RF_EN: U6.18(PB0) ; off-sheet RF_EN
RX: P6.1 U6.31(PA10)
SCK: U6.26(PB13) ; off-sheet SCK
SS: U6.25(PB12) ; off-sheet SS
trig: P6.3 U6.29(PA8)
TX: P6.2 U6.30(PA9)
NetC33_2: C33.2 U6.5(OSC_IN/PD0) Y1.1(OSC1)
NetC34_2: C34.2 U6.6(OSC_OUT/PD1) Y1.2(OSC2)
NetLED5_A: LED5.A U6.43(PB7)
NetLED5_K: LED5.K R21.1

Not connected (* = marked no-connect by the designer): U6 2(PC13-TAMPER-RTC) 3(PC14-OSC32_IN) 4(PC15-OSC32_OUT) 10(PA0-WKUP) 11(PA1) 12(PA2) 13(PA3) 14(PA4) 15(PA5) 16(PA6) 21(PB10) 22(PB11) 32(PA11) 33(PA12) 41(PB5) 42(PB6) 45(PB8) 46(PB9)

### Notes on the sheet
- Title
- Size:
- A4
- Number:
- Revision:
- Date:
- Time:
- Sheet
- of

### Library data of the parts
C32-C34 C41-C44 = CAPC_10u_0805_10V: Capacitor SMD Cer 10uF 10% 10V X5R 0805; Manufacturer 1: AVX Corporation; Manufacturer Part Number 1: 0805ZD106KAT2A; Ratings: 10V; X5R; Material: ceramic; SCDType: spec; Package / Case: 0805 (2012 metric); Tolerance: ±10%; Manufacturer 2: Kemet; Manufacturer Part Number 2: C0805C106K8PACTU; Supplier 1: Digi-Key; Supplier Part Number 1: 478-5167-1-ND; ComponentLink1URL: http://www.avx.com/docs/Catalogs/cx5r.pdf; ComponentLink1Description: http://www.avx.com/docs/Catalogs/cx5r.pdf; ComponentLink2URL: http://www.kemet.com/datasheets&C0805C106K8PACTU; ComponentLink2Description: http://www.kemet.com/datasheets&C0805C106K8PACTU; Supplier 2: Digi-Key; Supplier Part Number 2: 399-4925-1-ND
LED5 = LED_SMD_Green_0603_570nm: as LED1 on sheet MAX_2870; Package / Case: 0603 (1608 metric); Color: Green; Current - Test: 20mA; Supplier 1: Digi-Key; Supplier Part Number 1: 754-1116-1-ND; RoHS 1: RoHS Compliant; Wavelength - Dominant: 570nm; ComponentLink1URL: http://www.us.kingbright.com/images/catalog/SPEC/APT1608CGCK.pdf; ComponentLink1Description: http://www.us.kingbright.com/images/catalog/SPEC/APT1608CGCK.pdf
P5 = Header 7: Header, 7-Pin; LatestRevisionDate: 17-Jul-2002; LatestRevisionNote: Re-released for DXP Platform.; Publisher: Altium Limited
P6 = Header 4: Header, 4-Pin; LatestRevisionDate: 17-Jul-2002; LatestRevisionNote: Re-released for DXP Platform.; Publisher: Altium Limited
R20-R22 = RES_1K_0402_5%: Resistor SMD chip 1k Ohm 0.063W 5% 0402; Manufacturer 1: Yageo; Manufacturer Part Number 1: RC0402JR-071KL; Ratings: 1/16 W; SCDType: spec; Package / Case: 0402 (1005 Metric); Tolerance: ±5%; Supplier 1: Digi-Key; Supplier Part Number 1: 311-1.0KJRCT-ND; RoHS 1: RoHS Compliant; ComponentLink1URL: http://www.yageo.com/documents/recent/PYu-RC0402_51_RoHS_L_6.pdf; ComponentLink1Description: http://www.yageo.com/documents/recent/PYu-RC0402_51_RoHS_L_6.pdf; Supplier 2: Digi-Key; Supplier Part Number 2: 541-1.0KJCT-ND; Manufacturer 2: Vishay Dale; Manufacturer Part Number 2: CRCW04021K00JNED; RoHS 2: RoHS Compliant; ComponentLink2URL: http://www.vishay.com/doc?20035; ComponentLink2Description: http://www.vishay.com/doc?20035; Supplier 3: Digi-Key; Supplier Part Number 3: 1276-4376-1-ND; Manufacturer 3: Samsung Electro-Mechanics America, Inc; Manufacturer Part Number 3: RC1005J102CS; RoHS 3: RoHS Compliant; ComponentLink3URL: http://www.samsungsem.com/servlet/FileDownload?filename=productcatalog/pdf/Chip_Resistor.pdf; ComponentLink3Description: http://www.samsungsem.com/servlet/FileDownload?filename=productcatalog/pdf/Chip_Resistor.pdf; Supplier 4: Digi-Key; Supplier Part Number 4: RHM1.0KCECT-ND; Manufacturer 4: Rohm Semiconductor; Manufacturer Part Number 4: MCR01MRTJ102; RoHS 4: RoHS Compliant; ComponentLink4URL: http://rohmfs.rohm.com/en/products/databook/datasheet/passive/resistor/chip_resistor/mcr_g.pdf; ComponentLink4Description: http://rohmfs.rohm.com/en/products/databook/datasheet/passive/resistor/chip_resistor/mcr_g.pdf; Supplier 5: Digi-Key; Supplier Part Number 5: P1.0KJCT-ND; Manufacturer 5: Panasonic Electronic Components; Manufacturer Part Number 5: ERJ-2GEJ102X; RoHS 5: RoHS Compliant; ComponentLink5URL: http://industrial.panasonic.com/www-cgi/jvcr13pz.cgi?E+PZ+3+AOA0001+ERJ2GEJ102X+7+WW; ComponentLink5Description: http://industrial.panasonic.com/www-cgi/jvcr13pz.cgi?E+PZ+3+AOA0001+ERJ2GEJ102X+7+WW
U6 = STM32F101CBT6: STM32 ARM-based 32-bit MCU with 128 Kbytes Flash, 48-pin LQFP, Industrial Temperature; Published: 30-May-2008; DatasheetVersion: rev6, Mar-2008; PackageVersion: Mar-2008; PackageReference: LQFP48; Publisher: Altium Limited; PackageDescription: 48-Pin Low-Profile Quad Flat Pack, 7 x 7 mm Body, 0.5 mm Pitch (LQFP48); ComponentLink1Description: Manufacturer Link; ComponentLink1URL: www.st.com/stm32; ComponentLink2Description: Datasheet; ComponentLink2URL: http://www.st.com/stonline/products/literature/ds/13586.pdf
Y1 = XTAL: Crystal Oscillator; Published: 8-Jun-2000; LatestRevisionDate: 17-Jul-2002; LatestRevisionNote: Re-released for DXP Platform.; PackageReference: R38; Publisher: Altium Limited; PackageDescription: Crystal, Thru-Hole; 2 Leads; Body 3.1 x 8.2 mm (Dia.xH)

## Nets that join several sheets
GND: MAX_2870 (R15.2 R16.2 R23.2), Power_Supply (11 pins), PLL_Controller_STM32 (P5.7)
GND_DIG: MAX_2870 (9 pins), Power_Supply (LED_DIG.K), PLL_Controller_STM32 (13 pins)
GND_PLL: MAX_2870 (10 pins), Power_Supply (LED_PLL.K)
VCC_DIG: MAX_2870 (12 pins), Power_Supply (C31.1 R19.1 U4.2 U4.4), PLL_Controller_STM32 (11 pins)
VCC_PLL: MAX_2870 (7 pins), Power_Supply (C29.1 R18.1 U3.2 U3.4)
VCC_RF: MAX_2870 (12 pins), Power_Supply (C27.1 R17.1 U2.2 U2.4)
CE: MAX_2870 (R12.2 U1.4), PLL_Controller_STM32 (U6.20)
LD: MAX_2870 (LED1.A R5.1 U1.25), PLL_Controller_STM32 (U6.19)
MISO: MAX_2870 (R3.1 U1.30), PLL_Controller_STM32 (U6.27)
MOSI: MAX_2870 (R10.2 U1.2), PLL_Controller_STM32 (U6.28)
RF_EN: MAX_2870 (R4.1 U1.26), PLL_Controller_STM32 (U6.18)
SCK: MAX_2870 (R8.2 U1.1), PLL_Controller_STM32 (U6.26)
SS: MAX_2870 (R11.2 U1.3), PLL_Controller_STM32 (U6.25)